# Altium schematic sheet SMI Bank 12.SchDoc
size A3; SheetNumber: 26; SheetTotal: 32
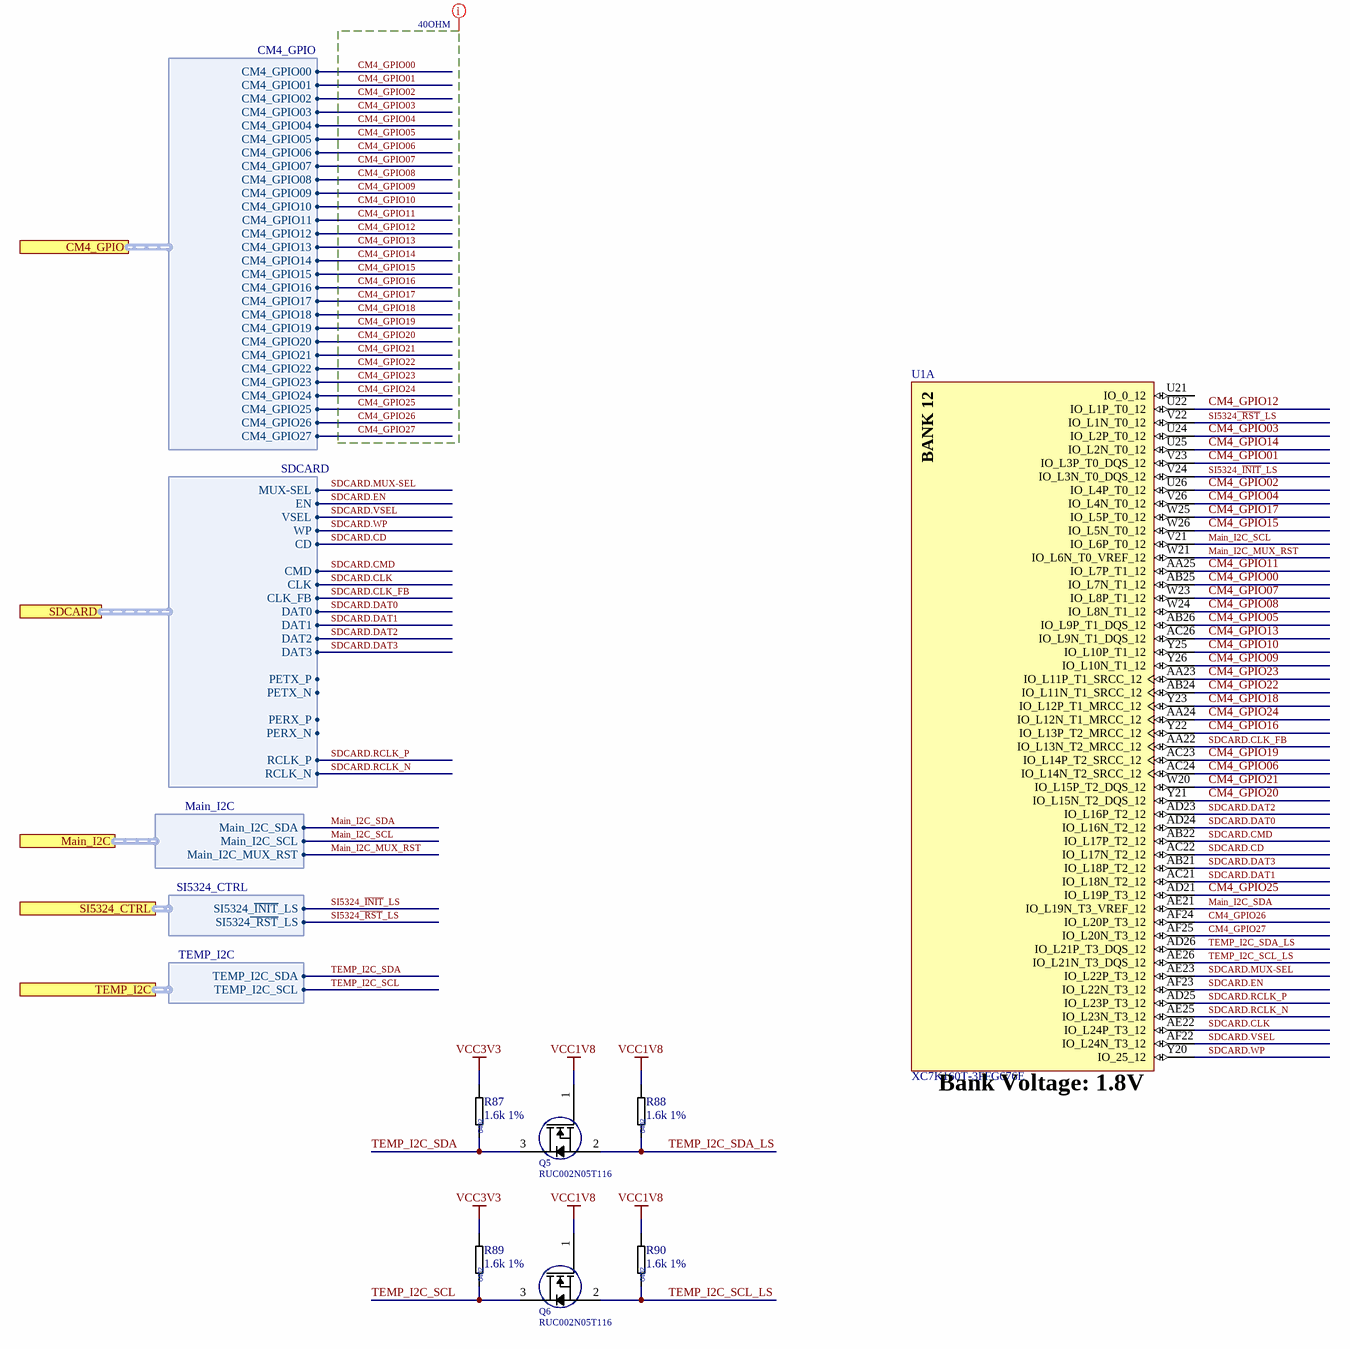
[diagram p0: SMI Bank 12.SchDoc]

## Parts
Q5  RUC002N05T116  [SOT95P251X112-3N]
Q6  RUC002N05T116  [SOT95P251X112-3N]
R87  1.6k 1%  [RES_0402_L]
R88  1.6k 1%  [RES_0402_L]
R89  1.6k 1%  [RES_0402_L]
R90  1.6k 1%  [RES_0402_L]
U1  XC7K160T-3FFG676E  [BGA100P2700X2700X317-676N]  (part A of 14)

## Ports
CM4_GPIO (harness CM4_GPIO, see Top-Level-Sheet[4B], Raspberry Pi CM4[8D]), Main_I2C (harness Main_I2C, see Top-Level-Sheet[4B], I2C Multiplexer[1A]), SDCARD (harness SDCARD, see Top-Level-Sheet[4B], Memory-SD_UHS_II[1C], MGT Banks 115-116[8B]), SI5324_CTRL (harness SI5324_CTRL, see Top-Level-Sheet[4B], System Clocks[1A]), TEMP_I2C (harness TEMP_I2C, see Top-Level-Sheet[4B], Power-Tree[1D])

## Harnesses
Main_I2C: Main_I2C_SCL, Main_I2C_MUX_RST, Main_I2C_SDA
SI5324_CTRL: SI5324_~{INIT}_LS, SI5324~{_RST}_LS
TEMP_I2C: TEMP_I2C_SCL, TEMP_I2C_SDA
CM4_GPIO: CM4_GPIO06, CM4_GPIO05, CM4_GPIO08, CM4_GPIO07, CM4_GPIO04, CM4_GPIO03, CM4_GPIO02, CM4_GPIO00, CM4_GPIO01, CM4_GPIO09, CM4_GPIO10, CM4_GPIO11, CM4_GPIO12, CM4_GPIO13, CM4_GPIO14, CM4_GPIO15, CM4_GPIO16, CM4_GPIO17, CM4_GPIO18, CM4_GPIO19, CM4_GPIO20, CM4_GPIO21, CM4_GPIO22, CM4_GPIO23, CM4_GPIO24, CM4_GPIO25, CM4_GPIO26, CM4_GPIO27
SDCARD: MUX-SEL, EN, VSEL, WP, CD, CMD, CLK, CLK_FB, PETX_P, PETX_N, DAT0, DAT1, DAT2, DAT3, PERX_P, PERX_N, RCLK_P, RCLK_N

## Nets
VCC1V8: Q5.1(G) Q6.1(G) R88.2 R90.2
VCC3V3: R87.2 R89.2
CM4_GPIO00: U1.AB25(IO_L7N_T1_12) ; port CM4_GPIO.CM4_GPIO00
CM4_GPIO01: U1.V23(IO_L3P_T0_DQS_12) ; port CM4_GPIO.CM4_GPIO01
CM4_GPIO02: U1.U26(IO_L4P_T0_12) ; port CM4_GPIO.CM4_GPIO02
CM4_GPIO03: U1.U24(IO_L2P_T0_12) ; port CM4_GPIO.CM4_GPIO03
CM4_GPIO04: U1.V26(IO_L4N_T0_12) ; port CM4_GPIO.CM4_GPIO04
CM4_GPIO05: U1.AB26(IO_L9P_T1_DQS_12) ; port CM4_GPIO.CM4_GPIO05
CM4_GPIO06: U1.AC24(IO_L14N_T2_SRCC_12) ; port CM4_GPIO.CM4_GPIO06
CM4_GPIO07: U1.W23(IO_L8P_T1_12) ; port CM4_GPIO.CM4_GPIO07
CM4_GPIO08: U1.W24(IO_L8N_T1_12) ; port CM4_GPIO.CM4_GPIO08
CM4_GPIO09: U1.Y26(IO_L10N_T1_12) ; port CM4_GPIO.CM4_GPIO09
CM4_GPIO10: U1.Y25(IO_L10P_T1_12) ; port CM4_GPIO.CM4_GPIO10
CM4_GPIO11: U1.AA25(IO_L7P_T1_12) ; port CM4_GPIO.CM4_GPIO11
CM4_GPIO12: U1.U22(IO_L1P_T0_12) ; port CM4_GPIO.CM4_GPIO12
CM4_GPIO13: U1.AC26(IO_L9N_T1_DQS_12) ; port CM4_GPIO.CM4_GPIO13
CM4_GPIO14: U1.U25(IO_L2N_T0_12) ; port CM4_GPIO.CM4_GPIO14
CM4_GPIO15: U1.W26(IO_L5N_T0_12) ; port CM4_GPIO.CM4_GPIO15
CM4_GPIO16: U1.Y22(IO_L13P_T2_MRCC_12) ; port CM4_GPIO.CM4_GPIO16
CM4_GPIO17: U1.W25(IO_L5P_T0_12) ; port CM4_GPIO.CM4_GPIO17
CM4_GPIO18: U1.Y23(IO_L12P_T1_MRCC_12) ; port CM4_GPIO.CM4_GPIO18
CM4_GPIO19: U1.AC23(IO_L14P_T2_SRCC_12) ; port CM4_GPIO.CM4_GPIO19
CM4_GPIO20: U1.Y21(IO_L15N_T2_DQS_12) ; port CM4_GPIO.CM4_GPIO20
CM4_GPIO21: U1.W20(IO_L15P_T2_DQS_12) ; port CM4_GPIO.CM4_GPIO21
CM4_GPIO22: U1.AB24(IO_L11N_T1_SRCC_12) ; port CM4_GPIO.CM4_GPIO22
CM4_GPIO23: U1.AA23(IO_L11P_T1_SRCC_12) ; port CM4_GPIO.CM4_GPIO23
CM4_GPIO24: U1.AA24(IO_L12N_T1_MRCC_12) ; port CM4_GPIO.CM4_GPIO24
CM4_GPIO25: U1.AD21(IO_L19P_T3_12) ; port CM4_GPIO.CM4_GPIO25
CM4_GPIO26: U1.AF24(IO_L20P_T3_12) ; port CM4_GPIO.CM4_GPIO26
CM4_GPIO27: U1.AF25(IO_L20N_T3_12) ; port CM4_GPIO.CM4_GPIO27
Main_I2C_MUX_RST: U1.W21(IO_L6N_T0_VREF_12) ; port Main_I2C.Main_I2C_MUX_RST
Main_I2C_SCL: U1.V21(IO_L6P_T0_12) ; port Main_I2C.Main_I2C_SCL
Main_I2C_SDA: U1.AE21(IO_L19N_T3_VREF_12) ; port Main_I2C.Main_I2C_SDA
SDCARD.CD: U1.AC22(IO_L17N_T2_12) ; port SDCARD.CD
SDCARD.CLK: U1.AE22(IO_L24P_T3_12) ; port SDCARD.CLK
SDCARD.CLK_FB: U1.AA22(IO_L13N_T2_MRCC_12) ; port SDCARD.CLK_FB
SDCARD.CMD: U1.AB22(IO_L17P_T2_12) ; port SDCARD.CMD
SDCARD.DAT0: U1.AD24(IO_L16N_T2_12) ; port SDCARD.DAT0
SDCARD.DAT1: U1.AC21(IO_L18N_T2_12) ; port SDCARD.DAT1
SDCARD.DAT2: U1.AD23(IO_L16P_T2_12) ; port SDCARD.DAT2
SDCARD.DAT3: U1.AB21(IO_L18P_T2_12) ; port SDCARD.DAT3
SDCARD.EN: U1.AF23(IO_L22N_T3_12) ; port SDCARD.EN
SDCARD.MUX-SEL: U1.AE23(IO_L22P_T3_12) ; port SDCARD.MUX-SEL
SDCARD.RCLK_N: U1.AE25(IO_L23N_T3_12) ; port SDCARD.RCLK_N
SDCARD.RCLK_P: U1.AD25(IO_L23P_T3_12) ; port SDCARD.RCLK_P
SDCARD.VSEL: U1.AF22(IO_L24N_T3_12) ; port SDCARD.VSEL
SDCARD.WP: U1.Y20(IO_25_12) ; port SDCARD.WP
SI5324~{_RST}_LS: U1.V22(IO_L1N_T0_12) ; port SI5324_CTRL.SI5324~{_RST}_LS
SI5324_~{INIT}_LS: U1.V24(IO_L3N_T0_DQS_12) ; port SI5324_CTRL.SI5324_~{INIT}_LS
TEMP_I2C_SCL: Q6.3(S) R89.1 ; port TEMP_I2C.TEMP_I2C_SCL
TEMP_I2C_SCL_LS: Q6.2(D) R90.1 U1.AE26(IO_L21N_T3_DQS_12)
TEMP_I2C_SDA: Q5.3(S) R87.1 ; port TEMP_I2C.TEMP_I2C_SDA
TEMP_I2C_SDA_LS: Q5.2(D) R88.1 U1.AD26(IO_L21P_T3_DQS_12)

Not connected (* = marked no-connect by the designer): U1 U21(IO_0_12)

## Layout directives
net class 40OHM: CM4_GPIO00, CM4_GPIO01, CM4_GPIO02, CM4_GPIO03, CM4_GPIO04, CM4_GPIO05, CM4_GPIO06, CM4_GPIO07, CM4_GPIO08, CM4_GPIO09, CM4_GPIO10, CM4_GPIO11, CM4_GPIO12, CM4_GPIO13, CM4_GPIO14, CM4_GPIO15, CM4_GPIO16, CM4_GPIO17, CM4_GPIO18, CM4_GPIO19, CM4_GPIO20, CM4_GPIO21, CM4_GPIO22, CM4_GPIO23, CM4_GPIO24, CM4_GPIO25, CM4_GPIO26, CM4_GPIO27

## Notes on the sheet
- (near U1) Bank Voltage: 1.8V
- Company:
- Contact:
- Customer:
- mail@pcb-arts.com
- PCB Arts GmbH
- Title:
- Project:
- The  information  contained  in  these  documents  is  confidential,  privileged  and  only  for  the information of the intended recipient and may not be used, published or redistributed Without the prior written consent from PCB Arts GmbH.
- Engineer:
- Document Number:
- Revision:
- Variant:
- Date:
- Time:
- Sheet:
- Status:
- /
- (in symbol RES_0402_1.6k_1%) 0402
- (in symbol XC7K160T-3FFG676E_Kintex-7 FPGA, 400 User I/Os, 8 GTX, FFG676, part A) BANK 12

## Library data of the parts
Q5 Q6 = RUC002N05T116_MOSFET N-Ch 1.2 VGS Spec: MOSFET N-Ch 1.2 VGS Spec; Manufacturer 1: ROHM Semiconductor; Manufacturer 1 Prt. Nr.: RUC002N05T116
R87-R90 = RES_0402_1.6k_1%: Thick Film Resistors - SMD 1.6kOhm 1%; Manufacturer 1: Vishay / Dale; Manufacturer 1 Prt. Nr.: CRCW04021K60FKEDC; Manufacturer 2 Prt. Nr.: RC0402FR-7W1K6L; Manufacturer 2: Yageo
U1 = XC7K160T-3FFG676E_Kintex-7 FPGA, 400 User I/Os, 8 GTX, FFG676: Kintex-7 FPGA, 400 User I/Os, 8 GTX, 676-Ball BGA, Speed Grade 3, Extended Grade, Pb-Free; Manufacturer 1: Xilinx; Manufacturer 1 Prt. Nr.: XC7K160T-3FFG676E; ComponentLink1URL: http://www.xilinx.com/support/documentation/data_sheets/ds180_7Series_Overview.pdf; ComponentLink2URL: http://www.xilinx.com/support/documentation/user_guides/ug865-Zynq-7000-Pkg-Pinout.pdf; ComponentLink1Description: Datasheet; ComponentLink2Description: Package Specification